# EasyEDA Pro project exBoard_4.eprj

# Schematic Schematic1
Board Name: Board1; Create Date: 2024-05-28; Page Name: P1; Project Name: exBoard_2; Schematic Name: Schematic1; Update Date: 2025-02-09; Company: 嘉立创EDA; Page Size: A4; Version: V1.0
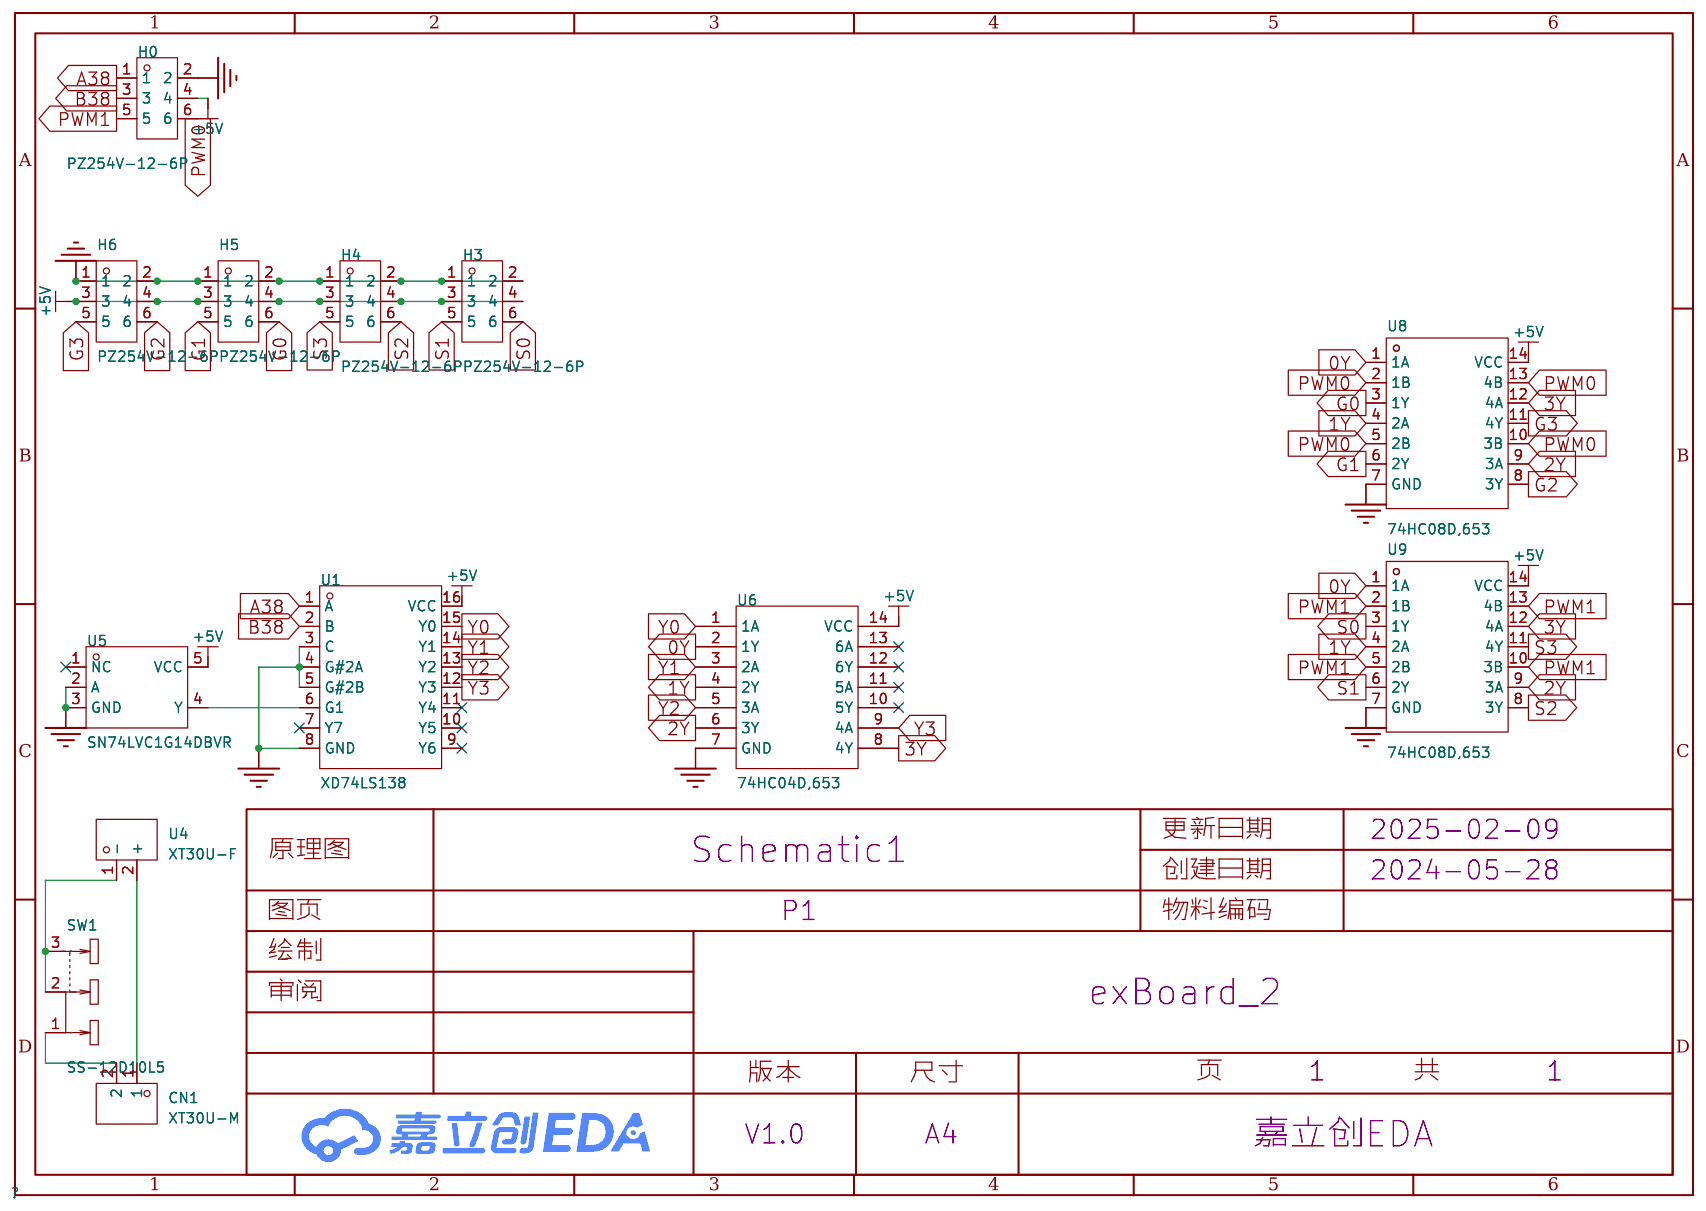
[diagram p0: schematic sheet]

## Parts
CN1  XT30U-M  [CONN-TH_XT30U-M]
H0  PZ254V-12-6P  [HDR-TH_6P-P2.54-V-M-R2-C3-S2.54]
H3  PZ254V-12-6P  [HDR-TH_6P-P2.54-V-M-R2-C3-S2.54]
H4  PZ254V-12-6P  [HDR-TH_6P-P2.54-V-M-R2-C3-S2.54]
H5  PZ254V-12-6P  [HDR-TH_6P-P2.54-V-M-R2-C3-S2.54]
H6  PZ254V-12-6P  [HDR-TH_6P-P2.54-V-M-R2-C3-S2.54]
SW1  SS-12D10L5  [SW-TH_SS-12D10L5]
U1  XD74LS138  [DIP-16_L19.8-W6.5-P2.54-LS7.6-BL]
U4  XT30U-F  [CONN-TH_XT30U-F]
U5  SN74LVC1G14DBVR  [SOT-23-5_L3.0-W1.7-P0.95-LS2.8-BR]
U6  74HC04D,653  [SOIC-14_L8.7-W3.9-P1.27-LS6.0-BL]
U8  74HC08D,653  [SOIC-14_L8.7-W3.9-P1.27-LS6.0-BL]
U9  74HC08D,653  [SOIC-14_L8.7-W3.9-P1.27-LS6.0-BL]

## Library data of the parts
CN1 = XT30U-M: 类别:-;类型1:-;; LCSC Part Name: AMASS(艾迈斯)轻量版锂电池插头公头 XT30U-M; Supplier Part: C99101; Manufacturer: AMASS(艾迈斯); JLCPCB Part Class: 扩展库; Datasheet: https://atta.szlcsc.com/upload/public/pdf/source/20170606/1496716542582.pdf; Supplier: LCSC; Brand: 艾迈斯; Type: 插头; Colour: 黄色; InterfaceType: 公头
H0 H3-H6 = PZ254V-12-6P: LCSC Part Name: 间距:2.54mm 2x3P 直插 方针; Supplier Part: C492420; Manufacturer: XFCN(兴飞); Supplier Footprint: 插件,P=2.54mm; JLCPCB Part Class: Extended Part; Datasheet: https://atta.szlcsc.com/upload/public/pdf/source/20200309/C492420_BAECB307B001054C09D200388220EAE6.pdf; Supplier: LCSC; Pin Structure: 2x3P; Pitch: 2.54mm; Row Spacing: 2.54mm; Circluar Pins/Square Pins: 方针; Mounting Type: 直插; Number of Rows: 双排; Number of Pins: 6P; Length of Mating Pin: 6mm; Insulation Height: 2.5mm; Length of End Connection Pin: 3mm; Contact Material: 黄铜; Operating Temperature Range: -40℃~+105℃; Color: 黑色
SW1 = SS-12D10L5: LCSC Part Name: 柄长5mm 直插双档 滑动开关; Supplier Part: C319012; Manufacturer: XKB Connectivity(中国星坤); Supplier Footprint: 插件; JLCPCB Part Class: 扩展库; Datasheet: https://atta.szlcsc.com/upload/public/pdf/source/20211009/D6412F37AABE6F9459A6EE7FA4DAEADB.pdf; Supplier: LCSC; Circuit: 单刀双掷; Actuator Style: 矩形柱状; Pin Style: PC引脚; Switch Length: 13mm; Switch Width: 6.8mm; Switch Height: 6.4mm; Mounting Style: 直插; Actuator Color: 黑色; Current Rating (DC): 3A; Voltage Rating (DC): 125V; Current Rating (AC): 3A; Voltage Rating (AC): 125V; Mechanical Life: 1万次; Operating Temperature: -40℃~+85℃
U1 = XD74LS138: LCSC Part Name: 编码器、解码器、复用器和解复用器; Supplier Part: C513527; Manufacturer: XINLUDA(信路达); Supplier Footprint: DIP-16; JLCPCB Part Class: Extended Part; Datasheet: https://atta.szlcsc.com/upload/public/pdf/source/20200619/C513527_D04113946337FFA11528F3555AE2E14A.pdf; Supplier: LCSC
U4 = XT30U-F: LCSC Part Name: AMASS(艾迈斯)轻量版锂电池插头母头 XT30U-F; Supplier Part: C99102; Manufacturer: AMASS(艾迈斯); JLCPCB Part Class: 扩展库; Datasheet: https://atta.szlcsc.com/upload/public/pdf/source/20190916/C428721_B0ECB8C5937139CEFE8736D2D3175B0E.pdf; Supplier: LCSC; Brand: 艾迈斯; Type: 插头; Colour: 黄色; InterfaceType: 母头
U5 = SN74LVC1G14DBVR_C434069: LCSC Part Name: 门极和反相器; Supplier Part: C434069; Manufacturer: UMW(友台半导体); Supplier Footprint: SOT-23-5; JLCPCB Part Class: 扩展库; Datasheet: https://atta.szlcsc.com/upload/public/pdf/source/20231109/6055D1B61DE2E899F5391931885BEAFC.pdf; Supplier: LCSC; Input Type: 施密特触发器; Supply Voltage(Single): 1.65V~5.5V; Supply Current (Max): 10uA; Number of Circuits: 1; Number of Inputs: 1; Sink Current: 32mA; Source Current: 32mA; High level range (VIH): 1V~3V; Low level range (VIL): 500mV~1.9V; Max Propagation Delay: 20ns@5V,15pF; Series: 74LVC系列; Operating Temperature: -40℃~+105℃
U6 = 74HC04D,653: LCSC Part Name: 六路反相器; Supplier Part: C5590; Manufacturer: Nexperia(安世); Supplier Footprint: SOIC-14; JLCPCB Part Class: 扩展库; Datasheet: https://atta.szlcsc.com/upload/public/pdf/source/20170918/C131317_1505726905601976309.pdf; Supplier: LCSC; Supply Voltage(Single): 2V~6V; Supply Current (Max): 2uA; Number of Circuits: 6; Number of Inputs: 1; Sink Current: 5.2mA; Source Current: 5.2mA; High level range (VIH): 1.5V~4.2V; Low level range (VIL): 500mV~1.8V; Max Propagation Delay: 14ns@6V,50pF; Series: 74HC系列; Operating Temperature: -40℃~+125℃
U8 U9 = 74HC08D,653: Supplier Part: C5593; Manufacturer: Nexperia(安世); Supplier Footprint: SOIC-14; JLCPCB Part Class: 扩展库; Datasheet: https://atta.szlcsc.com/upload/public/pdf/source/20200624/C5593_29BD22E613BAE221D22F61679620A23D.pdf; Supplier: LCSC; Logic Gate Type: 与门; Number of Channels: 4; Supply Voltage: 2V~6V; Quiescent Current (Max): 2uA; Sink Current: 5.2mA; Source Current: 5.2mA; High Level Range (VIH): 1.5V~4.2V; Low Level Range (VIL): 500mV~1.8V; Series: 74HC系列; Propagation Delay Time: 15ns@6V,50pF; Operating Temperature: -40℃~+125℃

## Nets
+5V: H0.4 H3.3 H3.4 H4.3 H4.4 H5.3 H5.4 H6.3 H6.4 U1.16(VCC) U5.5(VCC) U6.14(VCC) U8.14(VCC) U9.14(VCC)
GND: H0.2 H3.1 H3.2 H4.1 H4.2 H5.1 H5.2 H6.1 H6.2 U1.3(C) U1.4(G#2A) U1.5(G#2B) U1.8(GND) U5.2(A) U5.3(GND) U6.7(GND) U8.7(GND) U9.7(GND)
0Y: U6.2(1Y) U8.1(1A) U9.1(1A)
1Y: U6.4(2Y) U8.4(2A) U9.4(2A)
2Y: U6.6(3Y) U8.9(3A) U9.9(3A)
3Y: U6.8(4Y) U8.12(4A) U9.12(4A)
A38: H0.1 U1.1(A)
B38: H0.3 U1.2(B)
G0: H5.6 U8.3(1Y)
G1: H5.5 U8.6(2Y)
G2: H6.6 U8.8(3Y)
G3: H6.5 U8.11(4Y)
PWM0: H0.6 U8.2(1B) U8.5(2B) U8.10(3B) U8.13(4B)
PWM1: H0.5 U9.2(1B) U9.5(2B) U9.10(3B) U9.13(4B)
S0: H3.6 U9.3(1Y)
S1: H3.5 U9.6(2Y)
S2: H4.6 U9.8(3Y)
S3: H4.5 U9.11(4Y)
Y0: U1.15(Y0) U6.1(1A)
Y1: U1.14(Y1) U6.3(2A)
Y2: U1.13(Y2) U6.5(3A)
Y3: U1.12(Y3) U6.9(4A)
$1N380: CN1.1 U4.2(+)
$1N13302: CN1.2 SW1.1
$1N13307: SW1.2 SW1.3 U4.1(-)
$1N14076: U1.6(G1) U5.4(Y)

Not connected (* = marked no-connect by the designer): U1 7(Y7)* 9(Y6)* 10(Y5)* 11(Y4)*; U5 1(NC)*; U6 10(5Y)* 11(5A)* 12(6Y)* 13(6A)*

# Board PCB7
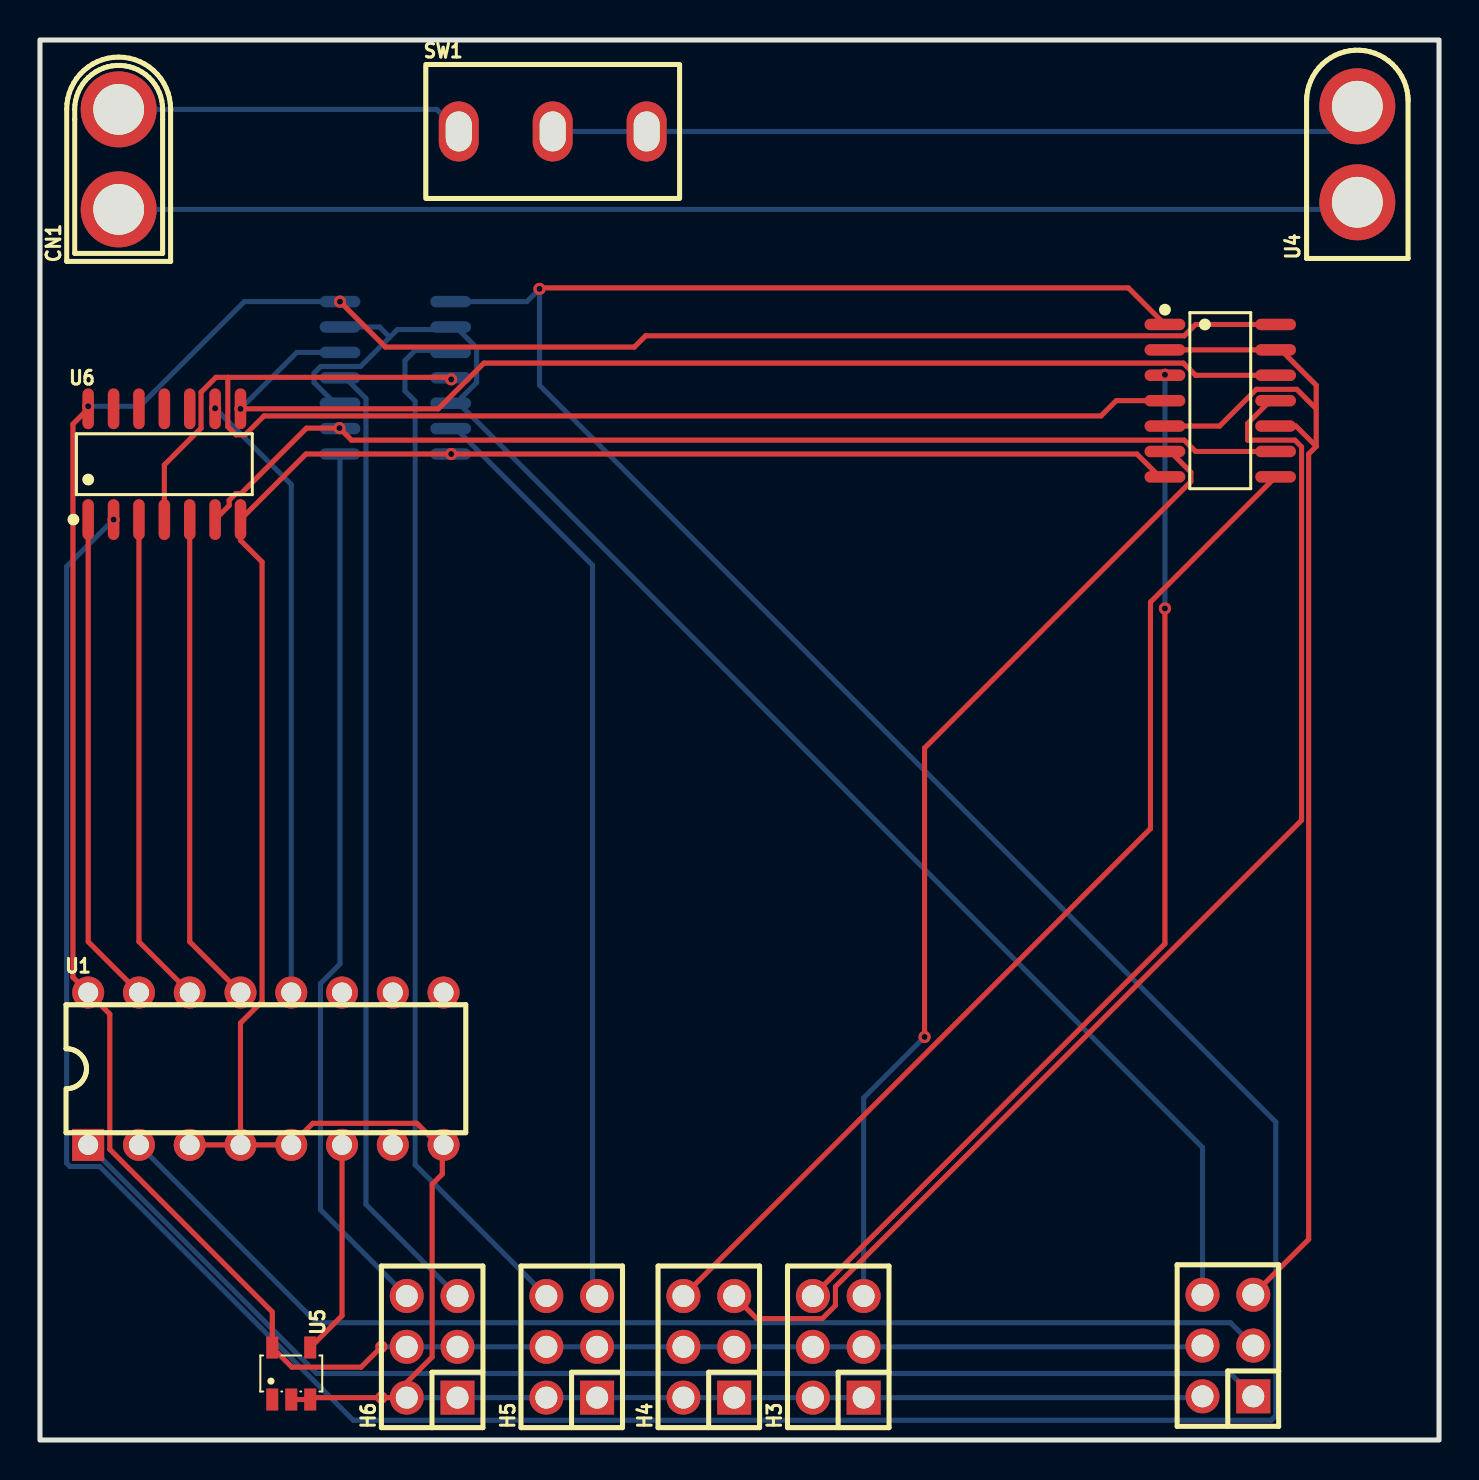
[diagram p1: board, top side]
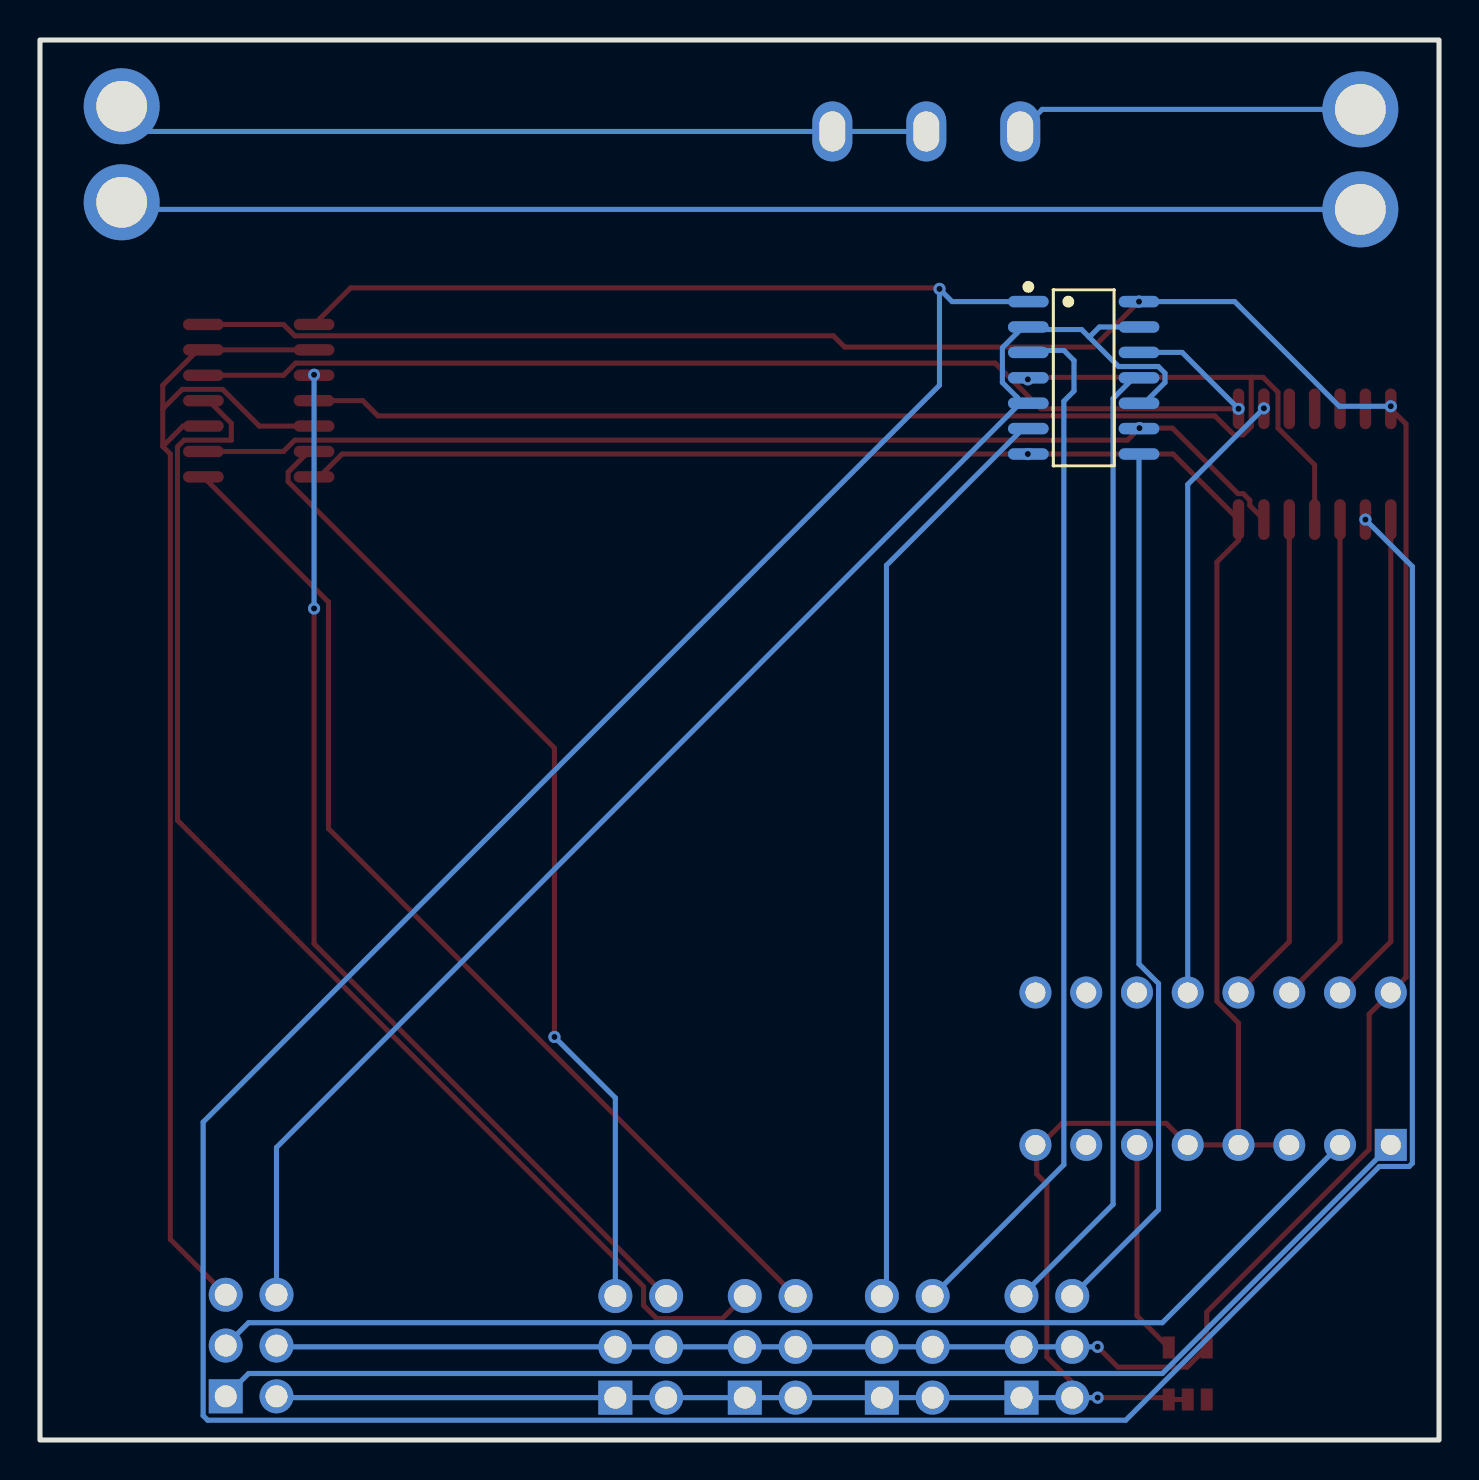
[diagram p2: board, bottom side, seen from below]

Outline 70 x 70 mm; copper layers: Top Layer, Bottom Layer. Coordinates in mm from the lower left corner of the outline.
Outline path: rectangle 0,70 70,0
Stack: Top Layer 0.035mm / Dielectric1 1.51mm FR4 er 4.5 / Bottom Layer 0.035mm

## Design rules (mm)
template: JLCPCB Capability(Two Layers Board)
spacing copperThickness1oz (default): track to track 0.102, other pairs 0.152 to 0.3
spacing copperThickness2oz: track to track 0.203, other pairs 0.152 to 0.3
track width copperThickness1oz (default): min 0.127, default 0.254, max 2.54
track width copperThickness2oz: min 0.203, default 0.254, max 2.54
differential pair differentialPair (default): width min 0.127, default 0.254, max 2.54; gap min 0.152, default 0.152
via viaSize (default): diameter min 0.5, default 0.61, max 10; hole min 0.3, default 0.305, max 6.3

## Placement (name value [footprint] x y rotation side)
CN1  XT30U-M  [CONN-TH_XT30U-M]  3.94 64.03 90 top
H0  PZ254V-12-6P  [HDR-TH_6P-P2.54-V-M-R2-C3-S2.54]  59.44 4.72 90 top
H3  PZ254V-12-6P  [HDR-TH_6P-P2.54-V-M-R2-C3-S2.54]  39.94 4.66 90 top
H4  PZ254V-12-6P  [HDR-TH_6P-P2.54-V-M-R2-C3-S2.54]  33.46 4.66 90 top
H5  PZ254V-12-6P  [HDR-TH_6P-P2.54-V-M-R2-C3-S2.54]  26.61 4.66 90 top
H6  PZ254V-12-6P  [HDR-TH_6P-P2.54-V-M-R2-C3-S2.54]  19.62 4.66 90 top
SW1  SS-12D10L5  [SW-TH_SS-12D10L5]  25.65 65.43 0 top
U1  XD74LS138  [DIP-16_L19.8-W6.5-P2.54-LS7.6-BL]  11.3 18.57 0 top
U4  XT30U-F  [CONN-TH_XT30U-F]  65.91 64.29 90 top
U5  SN74LVC1G14DBVR  [SOT-23-5_L3.0-W1.7-P0.95-LS2.8-BR]  12.57 3.33 270 top
U6  74HC04D,653  [SOIC-14_L8.7-W3.9-P1.27-LS6.0-BL]  6.22 48.79 0 top
U8  74HC08D,653  [SOIC-14_L8.7-W3.9-P1.27-LS6.0-BL]  17.78 53.11 270 bottom
U9  74HC08D,653  [SOIC-14_L8.7-W3.9-P1.27-LS6.0-BL]  59.05 51.97 270 top

## Footprints (pads in the part's own frame, mm; a bottom-side part is the same pattern mirrored in y, then rotated)
CONN-TH_XT30U-F
  round 3.8 hole 2.54: 1(2.4,0) 2(-2.4,0)
CONN-TH_XT30U-M
  round 3.8 hole 2.54: 1(-2.5,0) 2(2.5,0)
DIP-16_L19.8-W6.5-P2.54-LS7.6-BL
  rect 1.6x1.6 hole 1: 1(-8.89,-3.81)
  round 1.6 hole 1: 2(-6.35,-3.81) 3(-3.81,-3.81) 4(-1.27,-3.81) 5(1.27,-3.81) 6(3.81,-3.81) 7(6.35,-3.81) 8(8.89,-3.81) 9(8.89,3.81) 10(6.35,3.81) 11(3.81,3.81) 12(1.27,3.81) 13(-1.27,3.81) 14(-3.81,3.81) 15(-6.35,3.81) 16(-8.89,3.81)
HDR-TH_6P-P2.54-V-M-R2-C3-S2.54
  rect 1.7x1.7 hole 1.1: 1(-2.54,-1.27)
  round 1.7 hole 1.1: 2(-2.54,1.27) 3(0,-1.27) 4(0,1.27) 5(2.54,-1.27) 6(2.54,1.27)
SOIC-14_L8.7-W3.9-P1.27-LS6.0-BL
  oval 0.574x2.038 smd: 1(-3.81,-2.769) 2(-2.54,-2.769) 3(-1.27,-2.769) 4(0,-2.769) 5(1.27,-2.769) 6(2.54,-2.769) 7(3.81,-2.769) 8(3.81,2.769) 9(2.54,2.769) 10(1.27,2.769) 11(0,2.769) 12(-1.27,2.769) 13(-2.54,2.769) 14(-3.81,2.769)
SOT-23-5_L3.0-W1.7-P0.95-LS2.8-BR
  rect 1.1x0.6 smd: 1(1.3,-0.95) 2(1.3,0) 3(1.3,0.95) 4(-1.3,0.95) 5(-1.3,-0.95)
SW-TH_SS-12D10L5
  oval 2x3 hole 1.3x2: 1(-4.7,0) 2(0,0) 3(4.7,0)

## Nets
As in the schematic.

Pads without a net: U1 7 9 10 11; U5 1; U6 10 11 12 13

## Via types
v1: diameter 0.61, hole 0.305, Top Layer to Bottom Layer, 14 vias

## Routing (per net, layer and track width the routed paths; a pad name or vN(x,y) marks a point on that pad's centre or on a via; arc(x,y) is an arc through that point)
+5V: length 161.9
  Top Layer w0.254: U9.14 57.82,55.78 57.25,55.21 30.3,55.21 29.74,54.65 17.28,54.65 v1(15.01,56.92) ; v1(17.08,4.66) 16.07,3.64 12.61,3.64 U5.5 11.62,6.4 3.49,14.53 3.49,21.29 U1.16 1.65,23.14 1.65,50.8 U6.14 v1(2.41,51.69)
  Bottom Layer w0.254: v1(15.01,56.92) 10.22,56.92 4.99,51.69 v1(2.41,51.69) ; H0.4 58.1,4.66 H3.3 H3.4 H4.3 H4.4 H5.3 H5.4 H6.3 H6.4 v1(17.08,4.66)
GND: length 153.8
  Top Layer w0.254: U1.8 20.13,14.69 20.13,14.56 ; U1.4 10.03,20.85 11.11,21.93 11.11,43.9 10.03,44.98 U6.7 13.31,49.3 v1(20.57,49.3) 54.88,49.3 56.02,48.16 U9.7 ; U1.4 U1.5 13.65,15.83 18.86,15.83 20.13,14.56 ; U1.4 U1.3 ; 20.13,14.56 20.13,13.29 19.62,12.79 19.62,4.15 17.59,2.12 v1(17.08,2.12) 13.62,2.12 U5.3 U5.2
  Bottom Layer w0.254: v1(17.08,2.12) H6.2 H6.1 H5.2 H5.1 H4.2 H4.1 H3.2 H3.1 58.1,2.12 H0.2 ; v1(20.57,49.3) U8.7
0Y: length 207.5
  Top Layer w0.254: v1(24.99,57.55) 25.05,57.61 54.46,57.61 U9.1
  Bottom Layer w0.254: v1(3.68,46.02) 1.33,43.67 1.33,13.84 1.5,13.68 2.99,13.68 15.67,0.99 61.61,0.99 61.83,1.22 61.83,15.9 24.99,52.74 v1(24.99,57.55) 24.36,56.92 U8.1
1Y: length 70.3
  Top Layer w0.254: 9.4,53.13 8.8,53.13 8.06,52.39 8.06,50.59 6.22,48.76 U6.4 ; 9.4,53.13 9.4,50.66 9.8,50.26 10.27,50.26 11.21,51.2 53.09,51.2 53.85,51.97 U9.4 ; 9.4,53.13 20.47,53.13 v1(20.57,53.03)
  Bottom Layer w0.254: U8.4 20.55,53.06 v1(20.57,53.03)
2Y: length 55.6
  Top Layer w0.254: U6.6 9.47,46.73 9.47,46.99 9.8,47.32 10.06,47.32 13.33,50.59 v1(14.99,50.59) 15.59,49.99 57.25,49.99 57.82,49.43 61.82,49.43
3Y: length 59.1
  Top Layer w0.254: U9.12 57.82,53.24 57.21,53.85 22.21,53.85 19.93,51.56 v1(10.03,51.56)
  Bottom Layer w0.254: U8.12 12.85,54.38 v1(10.03,51.56)
A38: length 63.5
  Bottom Layer w0.254: U1.1 13.84,3.33 59.56,3.33 H0.1
B38: length 59.9
  Bottom Layer w0.254: H0.3 59.56,5.87 13.84,5.87 U1.2
G0: length 52.2
  Bottom Layer w0.254: U8.3 20.45,54.48 18.77,54.48 18.26,53.97 18.26,52.45 18.77,51.94 18.77,13.76 H5.6
G1: length 46.6
  Bottom Layer w0.254: H5.5 27.65,7.43 27.65,43.73 20.81,50.57 U8.6
G2: length 44.3
  Bottom Layer w0.254: H6.6 14.03,11.52 14.03,22.82 15.01,23.8 U8.8
G3: length 48.5
  Bottom Layer w0.254: H6.5 16.31,11.78 16.31,52.07 15.27,53.11 U8.11
PWM0: length 77.9
  Bottom Layer w0.254: 17.5,55.14 17.88,55.52 20.94,55.52 21.85,54.61 21.85,52.87 21.08,52.11 21.08,51.71 ; 17.5,55.14 16.03,53.68 14.04,53.68 13.71,53.34 13.71,52.87 14.75,51.84 U8.10 ; 17.5,55.14 16.99,55.65 U8.13 ; 21.08,51.71 20.68,51.71 U8.5 ; 21.08,51.71 58.17,14.63 H0.6
PWM1: length 66.3
  Top Layer w0.254: 63.86,49.68 62.84,50.7 U9.10 ; 63.86,49.68 63.48,49.3 63.48,10.03 H0.5 ; 63.86,49.68 63.86,51.56 ; 63.86,51.56 62.88,52.53 60.86,52.53 59.02,50.7 U9.5 ; 63.86,51.56 63.86,52.74 62.09,54.51 U9.13 U9.2
S0: length 53.4
  Top Layer w0.254: v1(56.29,53.26) U9.3 ; v1(56.29,41.58) 56.29,24.81 H3.6
  Bottom Layer w0.254: v1(56.29,41.58) v1(56.29,53.26)
S1: length 49.7
  Top Layer w0.254: 56.29,49.43 56.55,49.43 57.58,48.39 57.58,47.92 44.26,34.6 v1(44.26,20.15)
  Bottom Layer w0.254: H3.5 41.21,17.1 v1(44.26,20.15)
S2: length 53.2
  Top Layer w0.254: U9.8 55.56,41.89 55.56,30.57 H4.6
S3: length 63.9
  Top Layer w0.254: U9.11 61.56,51.97 60.43,50.83 60.43,49.99 62.79,49.99 63.12,49.66 63.12,30.99 39.8,7.67 39.8,6.73 39.14,6.07 35.86,6.07 H4.5
Y0: length 24.7
  Top Layer w0.254: U1.15 2.41,24.92 U6.1
Y1: length 24.7
  Top Layer w0.254: U6.3 4.95,24.92 U1.14
Y2: length 24.7
  Top Layer w0.254: U1.13 7.49,24.92 U6.5
Y3: length 30.8
  Bottom Layer w0.254: v1(8.76,51.59) 12.57,47.78 U1.12
$1N380: length 62.1
  Bottom Layer w0.254: CN1.1 65.56,61.53 U4.2
$1N13302: length 17.5
  Bottom Layer w0.254: CN1.2 19.85,66.53 SW1.1
$1N13307: length 40.8
  Bottom Layer w0.254: U4.1 64.66,65.43 SW1.2
$1N14076: length 10.8
  Top Layer w0.254: U5.4 15.11,6.22 U1.6
